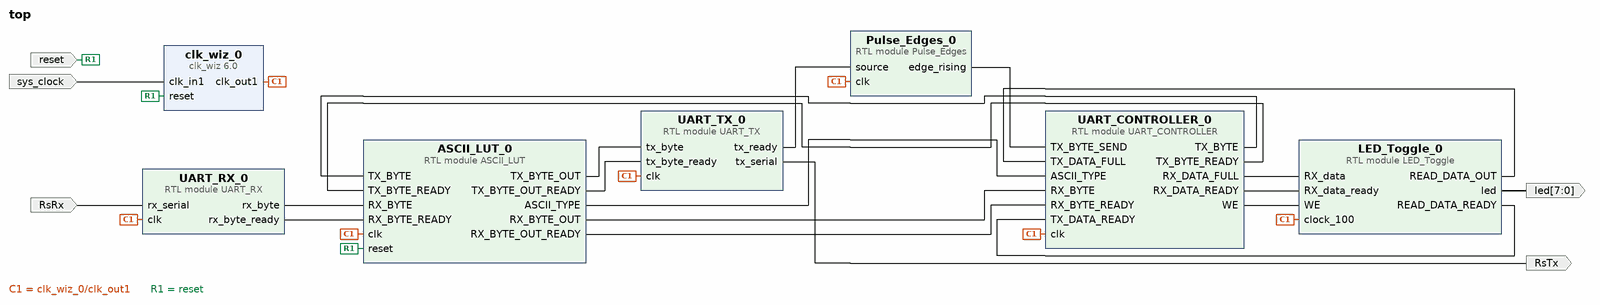
[diagram p0: block diagram of the top level]
# Vivado block design top, xc7a35tcpg236-1, Vivado 2023.2
create_bd_design top

create_bd_port -dir I -type clk sys_clock
set_property -dict {CONFIG.FREQ_HZ 100000000 CONFIG.PHASE 0.0} [get_bd_ports sys_clock]
create_bd_port -dir I -type rst reset
set_property -dict {CONFIG.POLARITY ACTIVE_HIGH} [get_bd_ports reset]
create_bd_port -dir I RsRx
create_bd_port -dir O RsTx
create_bd_port -dir O -from 7 -to 0 led

create_bd_cell -type ip -vlnv xilinx.com:ip:clk_wiz:6.0 clk_wiz_0
set_property -dict [list \
  CONFIG.CLK_IN1_BOARD_INTERFACE sys_clock \
  CONFIG.RESET_BOARD_INTERFACE reset \
  CONFIG.USE_BOARD_FLOW true \
] [get_bd_cells clk_wiz_0]
create_bd_cell -type module -reference ASCII_LUT ASCII_LUT_0
create_bd_cell -type module -reference UART_RX UART_RX_0
create_bd_cell -type module -reference UART_CONTROLLER UART_CONTROLLER_0
create_bd_cell -type module -reference UART_TX UART_TX_0
create_bd_cell -type module -reference LED_Toggle LED_Toggle_0
create_bd_cell -type module -reference Pulse_Edges Pulse_Edges_0

# ---- connections ----

connect_bd_net [get_bd_pins ASCII_LUT_0/ASCII_TYPE] [get_bd_pins UART_CONTROLLER_0/ASCII_TYPE]
connect_bd_net [get_bd_pins ASCII_LUT_0/RX_BYTE_OUT] [get_bd_pins UART_CONTROLLER_0/RX_BYTE]
connect_bd_net [get_bd_pins ASCII_LUT_0/RX_BYTE_OUT_READY] [get_bd_pins UART_CONTROLLER_0/RX_BYTE_READY]
connect_bd_net [get_bd_pins ASCII_LUT_0/TX_BYTE_OUT] [get_bd_pins UART_TX_0/tx_byte]
connect_bd_net [get_bd_pins ASCII_LUT_0/TX_BYTE_OUT_READY] [get_bd_pins UART_TX_0/tx_byte_ready]
connect_bd_net [get_bd_pins LED_Toggle_0/READ_DATA_OUT] [get_bd_pins UART_CONTROLLER_0/TX_DATA_FULL]
connect_bd_net [get_bd_pins LED_Toggle_0/READ_DATA_READY] [get_bd_pins UART_CONTROLLER_0/TX_DATA_READY]
connect_bd_net [get_bd_pins LED_Toggle_0/led] [get_bd_ports led]
connect_bd_net [get_bd_pins Pulse_Edges_0/edge_rising] [get_bd_pins UART_CONTROLLER_0/TX_BYTE_SEND]
connect_bd_net [get_bd_ports RsRx] [get_bd_pins UART_RX_0/rx_serial]
connect_bd_net [get_bd_pins UART_CONTROLLER_0/RX_DATA_FULL] [get_bd_pins LED_Toggle_0/RX_data]
connect_bd_net [get_bd_pins UART_CONTROLLER_0/RX_DATA_READY] [get_bd_pins LED_Toggle_0/RX_data_ready]
connect_bd_net [get_bd_pins UART_CONTROLLER_0/TX_BYTE] [get_bd_pins ASCII_LUT_0/TX_BYTE]
connect_bd_net [get_bd_pins UART_CONTROLLER_0/TX_BYTE_READY] [get_bd_pins ASCII_LUT_0/TX_BYTE_READY]
connect_bd_net [get_bd_pins UART_CONTROLLER_0/WE] [get_bd_pins LED_Toggle_0/WE]
connect_bd_net [get_bd_pins UART_RX_0/rx_byte] [get_bd_pins ASCII_LUT_0/RX_BYTE]
connect_bd_net [get_bd_pins UART_RX_0/rx_byte_ready] [get_bd_pins ASCII_LUT_0/RX_BYTE_READY]
connect_bd_net [get_bd_pins UART_TX_0/tx_ready] [get_bd_pins Pulse_Edges_0/source]
connect_bd_net [get_bd_pins UART_TX_0/tx_serial] [get_bd_ports RsTx]
connect_bd_net [get_bd_pins clk_wiz_0/clk_out1] \
  [get_bd_pins UART_RX_0/clk] [get_bd_pins UART_TX_0/clk] [get_bd_pins Pulse_Edges_0/clk] \
  [get_bd_pins LED_Toggle_0/clock_100] [get_bd_pins UART_CONTROLLER_0/clk] [get_bd_pins ASCII_LUT_0/clk]
connect_bd_net [get_bd_ports reset] [get_bd_pins clk_wiz_0/reset] [get_bd_pins ASCII_LUT_0/reset]
connect_bd_net [get_bd_ports sys_clock] [get_bd_pins clk_wiz_0/clk_in1]

set_property USER_COMMENTS.comment_0 {1. Data Recieved from
 terminal in raw form.} [current_bd_design]
set_property USER_COMMENTS.comment_1 {2. converts ASCII character
to numerical value / read / write character} [current_bd_design]
set_property USER_COMMENTS.comment_2 {3. Takes format of
W/R ADDR VALUE i.e
W 0001 0012

and assigns to register.} [current_bd_design]

validate_bd_design
save_bd_design
